# Altium project BMS_BQ29330.PrjPcb
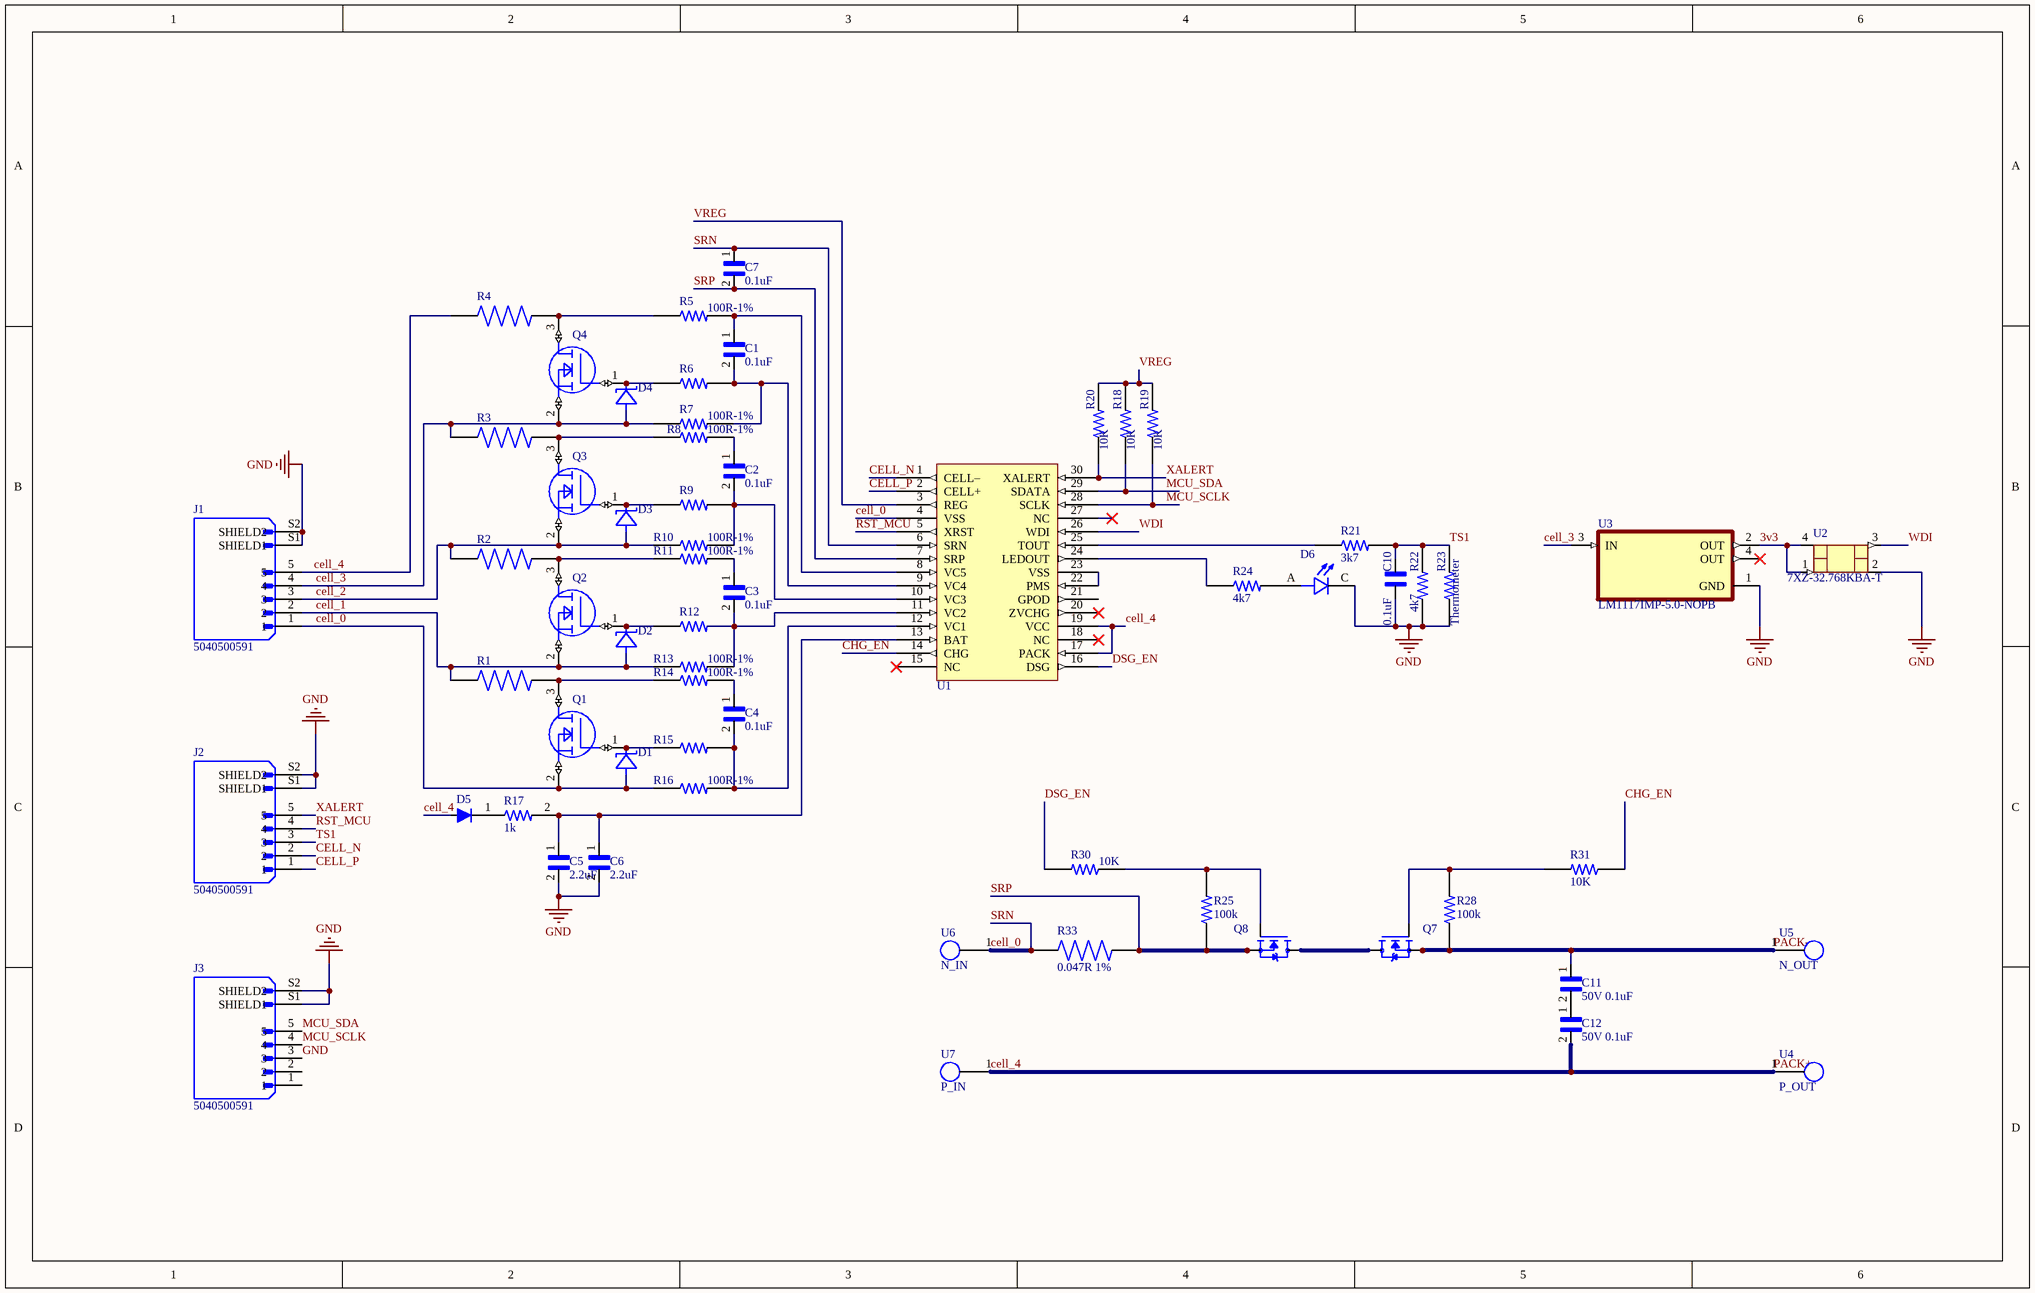
[diagram p0: BMS_Schematic.SchDoc]
1 sheet, 61 parts. Net scope: global (net labels, ports and power ports of the same name join across sheets).
Board file: BMS_PCB.PcbDoc

## Sheet BMS_Schematic.SchDoc
size 381 x 241 mm; SheetNumber: 1; SheetTotal: 1

### Parts
C1  0.1uF  [CAPC1608X90]
C2  0.1uF  [CAPC1608X90]
C3  0.1uF  [CAPC1608X90]
C4  0.1uF  [CAPC1608X90]
C5  2.2uF  [CAPC1608X90]
C6  2.2uF  [CAPC1608X90]
C7  0.1uF  [CAPC1608X90]
C10  0.1uF  [CAPC1608X90]
C11  50V 0.1uF  [CAPC1608X90]
C12  50V 0.1uF  [CAPC1608X90]
D1  MMSZ5232B+  [SOD123]  (value not drawn)
D2  MMSZ5232B+  [SOD123]  (value not drawn)
D3  MMSZ5232B+  [SOD123]  (value not drawn)
D4  MMSZ5232B+  [SOD123]  (value not drawn)
D5  MMSD4148T1G  [SOD123]  (value not drawn)
D6  SML-D12U1WT86  [LED_SML-D12Y1WT86]  (value not drawn)
J1  5040500591  [MOLEX_5040500591]
J2  5040500591  [MOLEX_5040500591]
J3  5040500591  [MOLEX_5040500591]
Q1  DMG2302UK-7  [SOT91P240X105-3N]  (value not drawn)
Q2  DMG2302UK-7  [SOT91P240X105-3N]  (value not drawn)
Q3  DMG2302UK-7  [SOT91P240X105-3N]  (value not drawn)
Q4  DMG2302UK-7  [SOT91P240X105-3N]  (value not drawn)
Q7  IPT60R028G7XTMA1  [TRANS_IPT60R028G7XTMA1]  (value not drawn)
Q8  IPT60R028G7XTMA1  [TRANS_IPT60R028G7XTMA1]  (value not drawn)
R1  ERJS1TJ561U  [RES_ERJS1TJ561U]  (value not drawn)
R2  ERJS1TJ561U  [RES_ERJS1TJ561U]  (value not drawn)
R3  ERJS1TJ561U  [RES_ERJS1TJ561U]  (value not drawn)
R4  ERJS1TJ561U  [RES_ERJS1TJ561U]  (value not drawn)
R5  100R-1%  [RESC1608X50N]
R6  8-1676481-6  [RESC1608X50N]  (value not drawn)
R7  100R-1%  [RESC1608X50N]
R8  100R-1%  [RESC1608X50N]
R9  8-1676481-6  [RESC1608X50N]  (value not drawn)
R10  100R-1%  [RESC1608X50N]
R11  100R-1%  [RESC1608X50N]
R12  8-1676481-6  [RESC1608X50N]  (value not drawn)
R13  100R-1%  [RESC1608X50N]
R14  100R-1%  [RESC1608X50N]
R15  8-1676481-6  [RESC1608X50N]  (value not drawn)
R16  100R-1%  [RESC1608X50N]
R17  1k  [RESC1608X50N]
R18  10K  [RESC1608X50N]
R19  10K  [RESC1608X50N]
R20  10K  [RESC1608X50N]
R21  3k7  [RESC1608X50N]
R22  4k7  [RESC1608X50N]
R23  Thermometer  [RESC1608X50N]
R24  4k7  [RESC1608X50N]
R25  100k  [RESC1608X50N]
R28  100k  [RESC1608X50N]
R30  10K  [RESC1608X50N]
R31  10K  [RESC1608X50N]
R33  0.047R 1%  [RES_ERJS1TJ561U]
U1  BQ29330  [SOP50P640X120-30N]  (value not drawn)
U2  7XZ-32.768KBA-T  [OSCCILATOR]
U3  LM1117IMP-5.0-NOPB  [SOT230P700X180-4N]
U4  P_OUT  [PCBComponent_1]
U5  N_OUT  [PCBComponent_1]
U6  N_IN  [PCBComponent_1]
U7  P_IN  [PCBComponent_1]

### Nets
GND: C5.2 C6.2 C10.2 D6.C J1.S1(SHIELD1) J1.S2(SHIELD2) J2.S1(SHIELD1) J2.S2(SHIELD2) J3.3 J3.S1(SHIELD1) J3.S2(SHIELD2) R22.1 R23.1 U2.2(GND) U3.1(GND)
3v3: U2.1(ENA) U2.4(VDD) U3.2(OUT)
cell_0: C7.1 D1.2(A) J1.1 Q1.2(S) R16.1 R33.1 U1.4(VSS) U1.6(SRN) U6.1  [also labelled SRN]
cell_1: D2.2(A) J1.2 Q2.2(S) R1.1 R13.1
cell_2: D3.2(A) J1.3 Q3.2(S) R2.1 R10.1
cell_3: D4.2(A) J1.4 Q4.2(S) R3.1 R7.1 U3.3(IN)
cell_4: C12.2 D5.A J1.5 R4.1 U1.17(PACK) U1.19(VCC) U4.1 U7.1  [also labelled PACK+]
CELL_N: J2.2 U1.1(CELL–)
CELL_P: J2.1 U1.2(CELL+)
CHG_EN: R31.1 U1.14(CHG)
DSG_EN: R30.2 U1.16(DSG)
MCU_SCLK: J3.4 R19.1 U1.28(SCLK)
MCU_SDA: J3.5 R18.1 U1.29(SDATA)
PACK-: C11.1 Q7.2(SOURCE) Q7.3(SOURCE) Q7.4(SOURCE) Q7.5(SOURCE) Q7.6(SOURCE) Q7.7(SOURCE) Q7.8(SOURCE) R28.1 U5.1
RST_MCU: J2.4 U1.5(XRST)
SRP: C7.2 Q8.2(SOURCE) Q8.3(SOURCE) Q8.4(SOURCE) Q8.5(SOURCE) Q8.6(SOURCE) Q8.7(SOURCE) Q8.8(SOURCE) R25.1 R33.2 U1.7(SRP)
TS1: C10.1 J2.3 R21.2 R22.2 R23.2
VREG: R18.2 R19.2 R20.2 U1.3(REG)
WDI: U1.26(WDI) U2.3(OUT)
XALERT: J2.5 R20.1 U1.30(XALERT)
NetC1_1: C1.1 R5.2 U1.8(VC5)
NetC1_2: C1.2 R6.2 R7.2 U1.9(VC4)
NetC2_1: C2.1 R8.2
NetC2_2: C2.2 R9.2 R10.2 U1.10(VC3)
NetC3_1: C3.1 R11.2
NetC3_2: C3.2 R12.2 R13.2 U1.11(VC2)
NetC4_1: C4.1 R14.2
NetC4_2: C4.2 R15.2 R16.2 U1.12(VC1)
NetC5_1: C5.1 C6.1 R17.2 U1.13(BAT)
NetC11_2: C11.2 C12.1
NetD1_1: D1.1(C) Q1.1(G) R15.1
NetD2_1: D2.1(C) Q2.1(G) R12.1
NetD3_1: D3.1(C) Q3.1(G) R9.1
NetD4_1: D4.1(C) Q4.1(G) R6.1
NetD5_C: D5.C R17.1
NetD6_A: D6.A R24.2
NetQ1_3: Q1.3(D) R1.2 R14.1
NetQ2_3: Q2.3(D) R2.2 R11.1
NetQ3_3: Q3.3(D) R3.2 R8.1
NetQ4_3: Q4.3(D) R4.2 R5.1
NetQ7_1: Q7.1(GATE) R28.2 R31.2
NetQ7_9: Q7.9(DRAIN) Q8.9(DRAIN)
NetQ8_1: Q8.1(GATE) R25.2 R30.1
NetR21_1: R21.1 U1.25(TOUT)
NetR24_1: R24.1 U1.24(LEDOUT)
NetU1_22: U1.22(PMS) U1.23(VSS)

Not connected (* = marked no-connect by the designer): J3 1 2; U1 15(NC)* 18(NC)* 20(ZVCHG)* 21(GPOD) 27(NC)*; U3 4(OUT)*

### Library data of the parts
C1-C7 C10-C12 = LD035C181JAB2A: CAP CER SMD; MF: AVX; MP: LD035C181JAB2A; SnapEDA_Link: https://www.snapeda.com/parts/LD035C181JAB2A/AVX/view-part/2034489/?ref=snap; Price: None; Availability: Unavailable; Package: 0603 AVX; Value: *
D1-D4 = MMSZ5232B+: Zener Diode 5.6V 500mW Â±5% Surface Mount SOD-123; MF: ON Semiconductor; Package: SOD-123 Fairchild Semiconductor; Check_prices: https://www.snapeda.com/parts/MMSZ5232B/ON%20Semiconductor/view-part/345101/?ref=eda; Value: *; MP: MMSZ5232B; SnapEDA_Link: https://www.snapeda.com/parts/MMSZ5232B/ON%20Semiconductor/view-part/345101/?ref=snap; Availability: Bad; Price: None
D5 = MMSD4148T1G: DIODE GEN PURP 100V 200MA SOD123; MF: ON Semiconductor; MP: MBR0520L; SnapEDA_Link: https://www.snapeda.com/parts/MBR0520L/ON%20Semiconductor/view-part/1413138/?ref=snap; Price: None; Availability: Unavailable; Package: SOD-123 ON Semiconductor; Value: *
D6 = SML-D12U1WT86: Red 620nm LED Indication - Discrete 2.2V 0603 _1608 Metric_; MF: Rohm; Package: 0603 Rohm; Price: None; MP: SML-D12U1WT86; Availability: Unavailable; SnapEDA_Link: https://www.snapeda.com/parts/SML-D12U1WT86/Rohm/view-part/481503/?ref=snap; Value: *
J1-J3 = 5040500591: Connector Header Surface Mount, Right Angle 5 position 0.059 (1.50mm); MF: Molex; Purchase-URL: https://pricing.snapeda.com/search/part/5040500591/?ref=eda; MP: 5040500591; Package: None; SnapEDA_Link: https://www.snapeda.com/parts/5040500591/Molex/view-part/3596761/?ref=snap; Availability: In Stock; Price: None; Value: *; Check_prices: https://www.snapeda.com/parts/5040500591/Molex/view-part/3596761/?ref=eda
Q1-Q4 = DMG2302UK-7: N-Channel 20 V 2.8A (Ta) 660mW (Ta) Surface Mount SOT-23-3; MF: Diodes Inc.; SnapEDA_Link: https://www.snapeda.com/parts/DMG2302UK-7/Diodes+Inc./view-part/?ref=snap; Price: None; Purchase-URL: https://pricing.snapeda.com/search/part/DMG2302UK-7/?ref=eda; Check_prices: https://www.snapeda.com/parts/DMG2302UK-7/Diodes+Inc./view-part/?ref=eda; MP: DMG2302UK-7; Availability: In Stock; Value: *; Package: SOT-23 Diodes Inc.
Q7 Q8 = IPT60R028G7XTMA1: Gives best-in-class FOM R DS_on_xE oss and R DS_on_xQ G | Enables best-in-class R DS_on_ in smallest footprint; MF: Infineon Technologies; Digi-Key_Part_Number: IPT60R028G7XTMA1CT-ND; SnapEDA_Link: https://www.snapeda.com/parts/IPT60R028G7XTMA1/Infineon%20Technologies/view-part/748997/?ref=snap; Package: PowerSFN-8 Infineon Technologies; MP: IPT60R028G7XTMA1; Digi-Key_Purchase_URL: https://www.digikey.com/product-detail/en/infineon-technologies/IPT60R028G7XTMA1/IPT60R028G7XTMA1CT-ND/8655821?utm_source=snapeda&utm_medium=aggregator&utm_campaign=symbol; Value: *
R5-R16 R18-R25 R28 R30 R31 = 8-1676481-6: CPF 0603 10K 0.1% 25PPM 1K RL; Package: None; Price: None; Value: *; MP: 8-1676481-6; Availability: Unavailable
R17 = 8-1676481-6: CPF 0603 30K 0.1% 25PPM 1K RL; Package: None; Price: None; Value: *; MP: 8-1676481-6; Availability: Unavailable
R33 = ERJS1TJ561U: Package: None; MP: ERJS1TJ561U; Value: *; Availability: Unavailable; Price: None
U2 = 7XZ-32.768KBA-T: Oscillator 32.768 Khz
U3 = LM1117IMP-5.0-NOPB: MF: Texas Instruments; MP: LM1117IMP50; Value: *; SnapEDA_Link: https://www.snapeda.com/parts/LM1117IMP50/Texas%20Instruments/view-part/77914/?ref=snap; Package: SOT-223 Texas Instruments; Availability: Unavailable; Price: None
U4-U7 = battery_socket: Soldering part
R1-R4 = ERJS1TJ561U: Package: None; MP: ERJS1TJ561U; Value: *; Availability: Unavailable; Price: None